# Altium schematic sheet LDOSUPPLY.SchDoc
size A
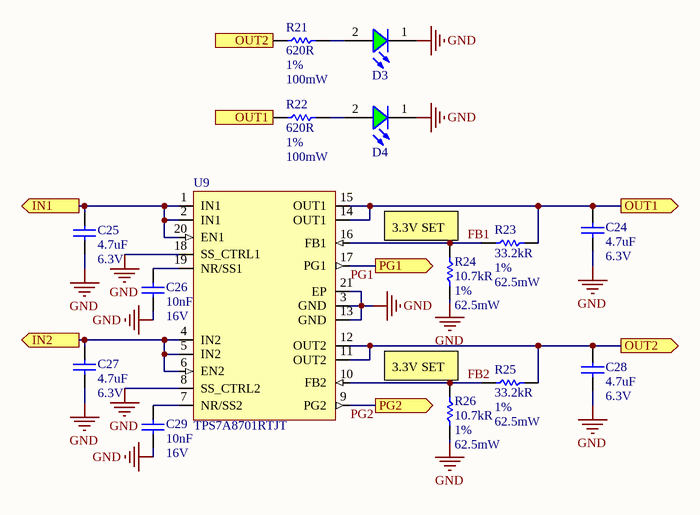
[diagram p0: LDOSUPPLY.SchDoc]

## Parts
C24  Capacitance: 4.7uF  Voltage Rating: 6.3V  [0402 CAPACITOR]  (hidden comment: CL10A475KQ8NNNC)
C25  Capacitance: 4.7uF  Voltage Rating: 6.3V  [0402 CAPACITOR]  (hidden comment: CL10A475KQ8NNNC)
C26  Capacitance: 10nF  Voltage Rating: 16V  [0402 CAPACITOR]  (hidden comment: MC0402B103J160CT)
C27  Capacitance: 4.7uF  Voltage Rating: 6.3V  [0402 CAPACITOR]  (hidden comment: CL10A475KQ8NNNC)
C28  Capacitance: 4.7uF  Voltage Rating: 6.3V  [0402 CAPACITOR]  (hidden comment: CL10A475KQ8NNNC)
C29  Capacitance: 10nF  Voltage Rating: 16V  [0402 CAPACITOR]  (hidden comment: MC0402B103J160CT)
D3  150060VS73220  [WL-SMCC_0603_RS_VS_YS]  (value not drawn)
D4  150060VS73220  [WL-SMCC_0603_RS_VS_YS]  (value not drawn)
R21  Resistance: 620R  Tolerance: 1%  Power Rating: 100mW  [0603 RESISTOR]  (hidden comment: MCMR06X6200FTL)
R22  Resistance: 620R  Tolerance: 1%  Power Rating: 100mW  [0603 RESISTOR]  (hidden comment: MCMR06X6200FTL)
R23  Resistance: 33.2kR  Tolerance: 1%  Power Rating: 62.5mW  [0402 RESISTOR]  (hidden comment: MCWR04X3322FTL)
R24  Resistance: 10.7kR  Tolerance: 1%  Power Rating: 62.5mW  [0402 RESISTOR]  (hidden comment: MCWR04X1072FTL)
R25  Resistance: 33.2kR  Tolerance: 1%  Power Rating: 62.5mW  [0402 RESISTOR]  (hidden comment: MCWR04X3322FTL)
R26  Resistance: 10.7kR  Tolerance: 1%  Power Rating: 62.5mW  [0402 RESISTOR]  (hidden comment: MCWR04X1072FTL)
U9  TPS7A8701RTJT  [QFN50P400X400X80_HS-21N]

## Ports
IN1 (out), IN2 (out), OUT1 (out), OUT2 (out), PG1 (out), PG2 (out)

## Nets
GND: C24.1 C25.1 C26.1 C27.1 C28.1 C29.1 D3.1(K) D4.1(K) R24.1 R26.1 U9.3(GND) U9.8(SS_CTRL2) U9.13(GND) U9.18(SS_CTRL1) U9.21(EP)
FB1: R23.2 R24.2 U9.16(FB1)
FB2: R25.2 R26.2 U9.10(FB2)
IN1: C25.2 U9.1(IN1) U9.2(IN1) U9.20(EN1) ; port IN1
IN2: C27.2 U9.4(IN2) U9.5(IN2) U9.6(EN2) ; port IN2
OUT1: C24.2 R22.2 R23.1 U9.14(OUT1) U9.15(OUT1) ; port OUT1
OUT2: C28.2 R21.2 R25.1 U9.11(OUT2) U9.12(OUT2) ; port OUT2
PG1: U9.17(PG1) ; port PG1
PG2: U9.9(PG2) ; port PG2
NetC26_2: C26.2 U9.19(NR/SS1)
NetC29_2: C29.2 U9.7(NR/SS2)
NetD3_2: D3.2(A) R21.1
NetD4_2: D4.2(A) R22.1

## Notes on the sheet
- (near R24) 3.3V SET
- (near R26) 3.3V SET

## Library data of the parts
C24 C25 C27 C28 = CMP-001-00091-2: Cap Ceramic 4.7uF 6.3V X5R 10% SMD 0402 85°C; Max Operating Temperature: 85°C; Radiation Hardening: No; Voltage: 6.3V; Case Code (Metric): 1608; Case/Package: 0603; Tolerance: 10%; Dielectric: X5R; Mount: Surface Mount; Packaging: Tape and Reel; Height: 0.8mm; Thickness: 0.035inch; Length: 1.6mm; Contact Plating: Tin; Package Quantity: 1; Depth: 0.8mm; Min Operating Temperature: -55°C; Width: 0.031inch; Material: Ceramic; Case Code (Imperial): 0603
C26 C29 = CMP-001-00090-2: Cap Ceramic 10nF 16V X7R 5% SMD 0402 125°C; Case Code (Imperial): 0402; Case Code (Metric): 1005; Packaging: Tape and Reel; Min Operating Temperature: -55°C; Voltage Rating (DC): 16V; Case/Package: 0402; Dielectric: X7R; REACH SVHC: Unknown; Tolerance: 5%; Max Operating Temperature: 125°C
D3 D4 = 150060VS73220: WL-SMCC SMD Mono-color Chip LED Compact, size 0603, Bright Green, 2V, 120deg; Dominant Wavelength: 573nm; Luminous Intensity: 60mcd; Peak Wavelength: 575nm; Chip Technology: AlInGaP; ComponentLink1URL: http://www.we-online.de; ComponentLink2Description: Datasheet; ComponentLink2URL: https://katalog.we-online.com/led/datasheet/150060VS73220.pdf; Part Number: 150060VS73220; Published Date: July 2019; Publisher: Wurth Elektronik; Size: 0603; Viewing Angle: 120deg; Packaging: Tape and Reel; Emitting Color: Bright Green; Mounting Technology: SMT; Forward Voltage: 2V; Operating Temperature: -40 to +85degC
R21 R22 = CMP-009-00202-2: RES, CERAMIC, 620R, 1%, 0.1W, 0603; Temperature Coefficient: 100ppm/°C; Voltage Rating: 75V; Case/Package: 0603; Case Code (Metric): 1608; Packaging: Cut Tape; REACH SVHC: No SVHC; Case Code (Imperial): 0603; Composition: Ceramic; Voltage Rating (DC): 75V
R23 R25 = CMP-009-00187-1: MULTICOMP - MCMR04X24R0FTL - RES, CERAMIC 33.2kR, 1%, 0.063W, 0402; Voltage Rating (DC): 50V; Temperature Coefficient: 100ppm/°C; Voltage Rating: 50V; Case Code (Imperial): 0402; Composition: Ceramic; Case Code (Metric): 1005; Packaging: Cut Tape; REACH SVHC: No SVHC; Case/Package: 0402
R24 R26 = CMP-009-00185-1: MULTICOMP - MCMR04X24R0FTL - RES, CERAMIC 10.7kR, 1%, 0.063W, 0402; Voltage Rating (DC): 50V; Temperature Coefficient: 100ppm/°C; Case Code (Metric): 1005; Composition: Ceramic; REACH SVHC: No SVHC; Case Code (Imperial): 0402; Packaging: Cut Tape; Voltage Rating: 50V; Case/Package: 0402
U9 = CMP-019-00051-1: IC REG LIN POS ADJ 500MA 20QFN; Min Input Voltage: 1.4V; Dropout Voltage: 100mV; Quiescent Current: 2.1mA; Voltage - Output 2: 5.2V; Number of Outputs: 2; Max Input Voltage: 6.5V; Packaging: Cut Tape; Lead Free: Lead Free; Current - Output 2: 500mA; REACH SVHC: No SVHC; Voltage - Output 1: 5.2V; Number of Pins: 20; Current - Output 1: 500mA; Min Operating Temperature: -40°C; Max Operating Temperature: 125°C